# Altium schematic sheet E17-15-TSAL_LED.SchDoc
size A
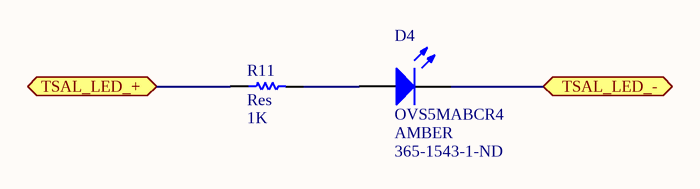
[diagram p0: E17-15-TSAL_LED.SchDoc]

## Parts
D4  OVS5MABCR4  Colour: AMBER  Supplier Part Number 1: 365-1543-1-ND  [OVS5MABCR4]
R11  Res  value 1K  [3216[1206]]

## Ports
TSAL_LED_+ (bidir), TSAL_LED_- (bidir)

## Nets
TSAL_LED_+: R11.1 ; port TSAL_LED_+
TSAL_LED_-: D4.2(K) ; port TSAL_LED_-
NetD4_1: D4.1(A) R11.2

## Library data of the parts
D4 = OVS5MABCR4: Typical AMBER LED; Published: 8-Jun-2000; LatestRevisionDate: 17-Jul-2002; LatestRevisionNote: Re-released for DXP Platform.; PackageDocument: Feb-2002; PackageReference: 3.2X1.6X1.1; Publisher: Altium Limited; Supplier 1: Digi-Key
R11 = Res: Surface Mount Resistor; Published: 8-Jun-2000; LatestRevisionDate: 17-Jul-2002; LatestRevisionNote: Re-released for DXP Platform.; PackageReference: AXIAL-0.5; Publisher: Altium Limited